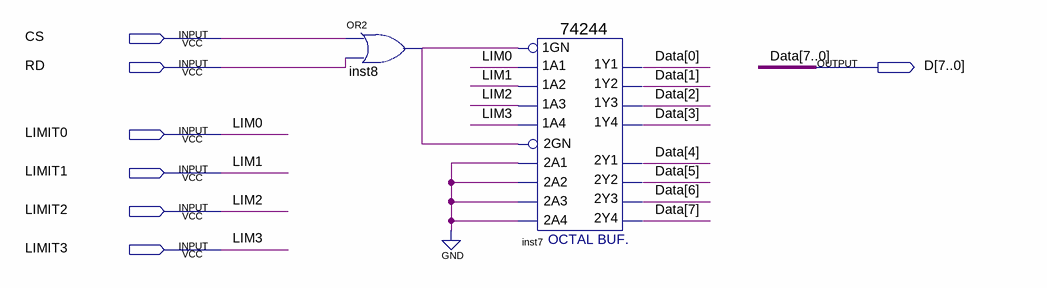
[diagram p0: schematic sheet]
// Quartus schematic read_limit.bdf as structural Verilog: 2 symbols, 7 pins
module read_limit (
  input  CS,
  input  RD,
  input  LIMIT0,
  input  LIMIT1,
  input  LIMIT2,
  input  LIMIT3,
  output [7:0] D
);

  wire inst8_out;

  or inst8 (inst8_out, CS, RD);
  \74244  inst7 (
    .\1A2 (LIMIT1), .\1A4 (LIMIT3), .\1A1 (LIMIT0), .\1A3 (LIMIT2), .\1GN (inst8_out), .\2A3 (1'b0),
    .\2GN (inst8_out), .\2A1 (1'b0), .\2A4 (1'b0), .\2A2 (1'b0), .\1Y2 (D[1]), .\1Y4 (D[3]), .\2Y1 (D[4]),
    .\1Y1 (D[0]), .\2Y3 (D[6]), .\2Y4 (D[7]), .\1Y3 (D[2]), .\2Y2 (D[5]));

  // Other names for the same wires on the sheet: Data[7:0] = D; LIM0 = LIMIT0; LIM1 = LIMIT1; LIM2 = LIMIT2;
  //   LIM3 = LIMIT3
endmodule
